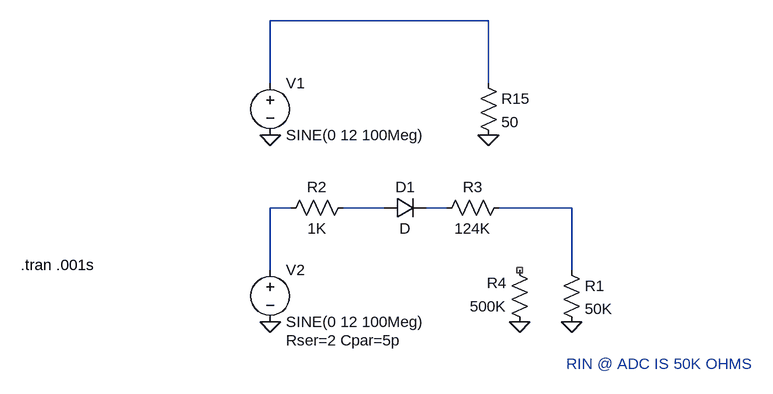
[diagram p0: schematic RVP+ATTN.asc]
RVP+ATTN.asc, the LTspice schematic file:
Version 4
SHEET 1 2916 680
WIRE 112 16 -224 16
WIRE -224 112 -224 16
WIRE 112 112 112 16
WIRE -192 304 -224 304
WIRE -48 304 -112 304
WIRE 48 304 16 304
WIRE 240 304 128 304
WIRE -224 400 -224 304
WIRE 240 400 240 304
FLAG -224 192 0
FLAG 112 192 0
FLAG -224 480 0
FLAG 240 480 0
FLAG 160 480 0
SYMBOL voltage -224 96 R0
WINDOW 123 0 0 Left 0
WINDOW 39 0 0 Left 0
SYMATTR InstName V1
SYMATTR Value SINE(0 12 100Meg)
SYMBOL res 96 96 R0
SYMATTR InstName R15
SYMATTR Value 50
SYMBOL voltage -224 384 R0
WINDOW 123 0 0 Left 0
WINDOW 39 24 124 Left 2
SYMATTR InstName V2
SYMATTR Value SINE(0 12 100Meg)
SYMATTR SpiceLine Rser=2 Cpar=5p
SYMBOL res 224 384 R0
SYMATTR InstName R1
SYMATTR Value 50K
SYMBOL res -96 288 R90
WINDOW 0 0 56 VBottom 2
WINDOW 3 32 56 VTop 2
SYMATTR InstName R2
SYMATTR Value 1K
SYMBOL diode -48 320 R270
WINDOW 0 32 32 VTop 2
WINDOW 3 0 32 VBottom 2
SYMATTR InstName D1
SYMBOL res 144 288 R90
WINDOW 0 0 56 VBottom 2
WINDOW 3 32 56 VTop 2
SYMATTR InstName R3
SYMATTR Value 124K
SYMBOL res 176 496 R180
WINDOW 0 36 76 Left 2
WINDOW 3 36 40 Left 2
SYMATTR InstName R4
SYMATTR Value 500K
TEXT -608 392 Left 2 !.tran .001s
TEXT 232 544 Left 2 ;RIN @ ADC IS 50K OHMS

The netlist it stands for:
* RVP+ATTN.asc
V1 N001 0 SINE(0 12 100Meg)
R15 N001 0 50
V2 N002 0 SINE(0 12 100Meg) Rser=2 Cpar=5p
R1 N005 0 50K
R2 N003 N002 1K
D1 N003 N004 D
R3 N005 N004 124K
R4 0 NC_01 500K
.model D D
.lib standard.dio
.tran .001s
* RIN @ ADC IS 50K OHMS
.backanno
.end